# EAGLE design i2c-ir (EAGLE 7.2.0)
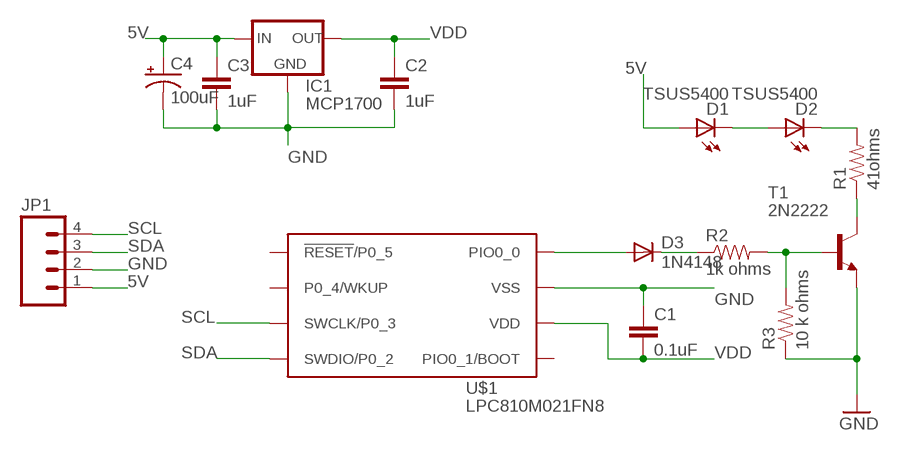
[diagram p0: schematic, sheet 1]

## Parts
C1  0.1uF  CAPPTH  [CAP-PTH-SMALL]
C2  1uF  CAPPTH  [CAP-PTH-SMALL]
C3  1uF  CAPPTH  [CAP-PTH-SMALL]
C4  100uF  CAP_POLPTH1  [CPOL-RADIAL-100UF-25V]
D1  TSUS5400  SFH482  [SFH482]
D2  TSUS5400  SFH482  [SFH482]
D3  1N4148  1N4148DO35-7  [DO35-7]
IC1  MCP1700  MCP1700INLINE  [TO92-INLINE]
JP1  M04PTH  [1X04]
R1  41ohms  RESISTORAXIAL-0.3  [AXIAL-0.3]
R2  1k ohms  RESISTORAXIAL-0.3  [AXIAL-0.3]
R3  10 k ohms  RESISTORAXIAL-0.3  [AXIAL-0.3]
T1  2N2222  [TO92-EBC-OVAL]
U$1  LPC810M021FN8  [DIP8]

## Nets
5V: C3.1 C4.1(+) D1.A IC1.2(IN) JP1.1
GND: C1.1 C2.2 C3.2 C4.2(-) IC1.1(GND) JP1.2 R3.P$1 T1.E U$1.P$7(VSS)
N$1: D1.K(C) D2.A
N$2: D2.K(C) R1.P$2
N$3: R1.P$1 T1.C
N$4: D3.A U$1.P$8(PIO0_0)
N$5: D3.C R2.P$1
N$6: R2.P$2 R3.P$2 T1.B
SCL: JP1.4 U$1.P$3(SWCLK/P0_3)
SDA: JP1.3 U$1.P$4(SWDIO/P0_2)
VDD: C1.2 C2.1 IC1.3(OUT) U$1.P$6(VDD)
Unconnected: U$1.P$1(!RESET!/P0_5) U$1.P$2(P0_4/WKUP) U$1.P$5(PIO0_1/BOOT)

## Library data of the parts
C1 = SparkFun-Capacitors:CAP: Capacitor Standard 0603 ceramic capacitor, and 0.1" leaded capacitor.
C2 C3 = SparkFun-Passives:CAP: Capacitor Standard 0603 ceramic capacitor, and 0.1" leaded capacitor.
C4 = SparkFun-Capacitors:CAP_POL: Capacitor Polarized These are standard SMD and PTH capacitors. Normally 10uF, 47uF, and 100uF in electrolytic and tantalum varieties. Always verify the external diameter of the through hole cap, it varies with capacity, voltage, and manufacturer. The EIA devices should be standard.
D1 D2 = led:SFH482: IR LED infrared emitting diode, Infineon
D3 = diode:1N4148: DIODE high speed (Philips)
IC1 = adafruit:MCP1700: VOLTAGE REGULATOR
JP1 = SparkFun-Connectors:M04: Header 4 Standard 4-pin 0.1" header. Use with straight break away headers (SKU : PRT-00116), right angle break away headers (PRT-00553), swiss pins (PRT-00743), machine pins (PRT-00117), and female headers (PRT-00115). Molex polarized connector foot print use with SKU : PRT-08231 with associated crimp pins and housings. 1MM SMD Version SKU: PRT-10208
R1-R3 = SparkFun-Passives:RESISTOR: Resistor Basic schematic elements and footprints for 0603, 1206, and PTH resistors.
T1 = adafruit:2N2222: NPN TRANSISTOR Big oval pads
U$1 = carrilib:LPC810

## Board
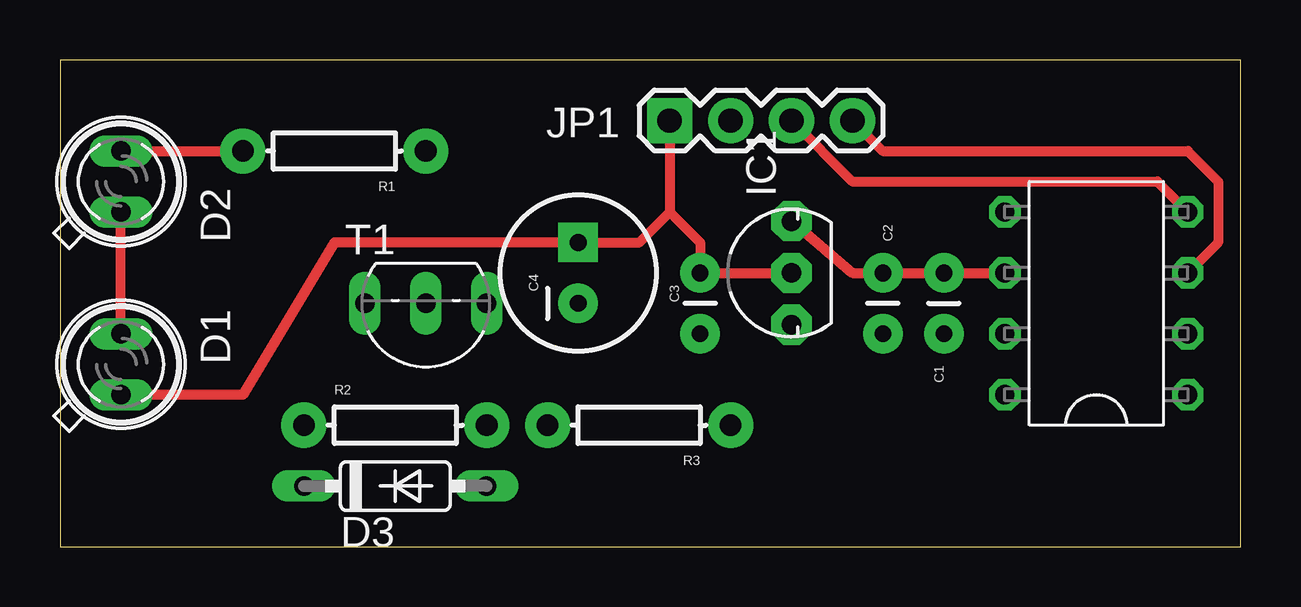
[diagram p1: board, top side]
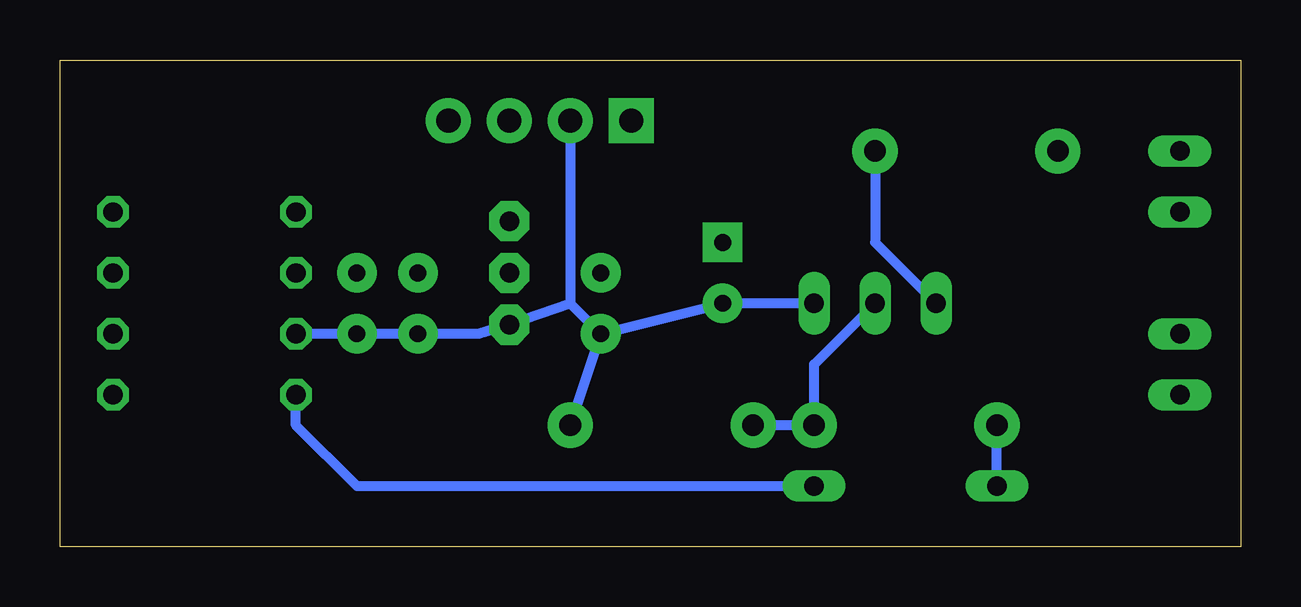
[diagram p2: board, bottom side, seen from below]

Size 49.2 x 20.31 mm. Coordinates in mm from the lower left corner, seen from the top.
Outline: 0,0 49.2,0 49.2,20.31 0,20.31 0,0
Copper layers (1*16): Top 0.035mm / dielectric 1.5mm / Bottom 0.035mm
Design rules "ITEADstudio_DRC": minimum track width 6mil, minimum drill 12mil, track to track 6mil, track to pad 6mil, pad to pad 6mil, via to via 6mil, smd to smd 0mil, copper to edge 10mil, drill to drill 10mil, minimum pad ring 10mil, minimum via ring 6mil, stop-mask expansion 2mil, vias tented up to drill 100mil, thermal gap 10mil

### Footprints (pad centres in the part's own frame; a part is rotated, then mirrored left to right if it is on the bottom)
CAP-PTH-SMALL = drill 0.7 pad 1.651: 1 0,0; 2 2.54,0
CPOL-RADIAL-100UF-25V = drill 0.7 pad 1.651 square: 1 1.27,0 | drill 0.7 pad 1.651: 2 -1.27,0
SFH482 = drill 0.813 long: A -1.27,0; K 1.27,0
DO35-7 = drill 0.813 long: A 3.81,0; C -3.81,0
TO92-INLINE = drill 0.813 pad 1.676 octagon: 1 -2.159,0; 2 0,0; 3 2.159,0
1X04 = drill 1.016 pad 1.88 square: 1 0,0 | drill 1.016 pad 1.88: 2 2.54,0; 3 5.08,0; 4 7.62,0
AXIAL-0.3 = drill 0.9 pad 1.88: P$1 -3.81,0; P$2 3.81,0
TO92-EBC-OVAL = drill 0.813 long: B 0,-1.27; C 2.54,-1.27; E -2.54,-1.27
DIP8 = drill 0.8 octagon: P$1 -3.81,3.81; P$2 -3.81,1.27; P$3 -3.81,-1.27; P$4 -3.81,-3.81; P$5 3.81,-3.81; P$6 3.81,-1.27; P$7 3.81,1.27; P$8 3.81,3.81

### Placement (x,y rotation side)
C1  36.83,8.89 90 top
C2  34.29,11.43 270 top
C3  26.67,11.43 270 top
C4  21.59,11.43 90 top
D1  2.54,7.62 90 top
D2  2.54,15.24 90 top
D3  13.97,2.54 0 top
IC1  30.48,11.43 90 top
JP1  25.4,17.78 0 top
R1  11.43,16.51 180 top
R2  13.97,5.08 0 top
R3  24.13,5.08 180 top
T1  15.24,8.89 180 top
U$1  43.18,10.16 180 top

### Tracks (layer width: path | path; a pad name or v marks a point on that pad's centre or on a via)
5V
  Top 0.406: D1.A 7.62,6.35 11.43,12.7 C4.1 24.13,12.7 25.4,13.97 | JP1.1 25.4,13.97 | 25.4,13.97 26.67,12.7 C3.1 IC1.2
GND
  Bottom 0.406: JP1.2 27.94,10.16 | U$1.P$7 C1.1 C2.2 31.75,8.89 IC1.1 27.94,10.16 | C3.2 C4.2 T1.E | C3.2 R3.P$1 | 27.94,10.16 C3.2
N$1
  Top 0.406: D1.K D2.A
N$2
  Top 0.406: D2.K R1.P$2
N$3
  Bottom 0.406: R1.P$1 15.24,12.7 T1.C
N$4
  Bottom 0.406: D3.A 36.83,2.54 39.37,5.08 U$1.P$8
N$5
  Bottom 0.406: D3.C R2.P$1
N$6
  Bottom 0.406: R3.P$2 R2.P$2 17.78,7.62 T1.B
SCL
  Top 0.406: JP1.4 34.29,16.51 46.99,16.51 48.26,15.24 48.26,12.7 U$1.P$3
SDA
  Top 0.406: U$1.P$4 45.72,15.24 33.02,15.24 JP1.3
VDD
  Top 0.406: U$1.P$6 C1.2 C2.1 33.02,11.43 IC1.3